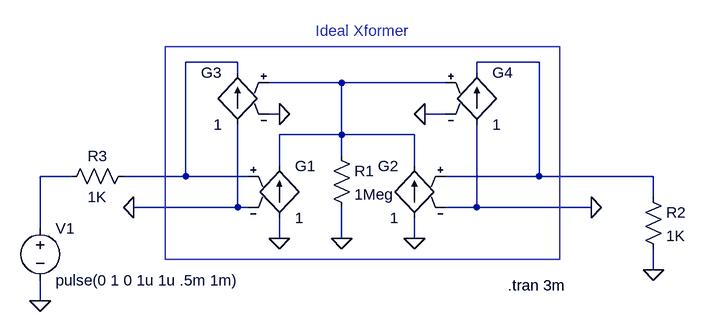
[diagram p0: schematic TxLin.asc]
TxLin.asc, the LTspice schematic file:
Version 4
SHEET 1 880 680
WIRE 0 240 -96 240
WIRE 0 288 -16 288
WIRE -16 288 -16 160
WIRE -16 288 -176 288
WIRE -16 80 -16 64
WIRE -16 64 -96 64
WIRE -96 64 -96 240
WIRE -96 240 -192 240
WIRE 304 240 448 240
WIRE 304 288 352 288
WIRE 352 288 352 160
WIRE 352 80 352 64
WIRE 352 64 448 64
WIRE 448 64 448 240
WIRE 448 240 624 240
WIRE 528 288 352 288
WIRE 48 336 48 304
WIRE 48 224 48 176
WIRE 48 176 144 176
WIRE 256 176 256 224
WIRE 256 304 256 336
WIRE 32 96 144 96
WIRE 144 96 144 176
WIRE 144 176 256 176
WIRE 144 96 304 96
WIRE 32 144 48 144
WIRE 304 144 272 144
WIRE 144 176 144 208
WIRE 144 288 144 336
WIRE -320 432 -320 400
WIRE -320 320 -320 240
WIRE 624 240 624 272
WIRE 624 352 624 384
WIRE -272 240 -320 240
FLAG 256 336 0
FLAG 48 336 0
FLAG 272 144 0
FLAG 48 144 0
FLAG 144 336 0
FLAG -176 288 0
FLAG 528 288 0
FLAG -320 432 0
FLAG 624 384 0
SYMBOL g 48 208 R0
SYMATTR InstName G1
SYMATTR Value 1
SYMBOL g 256 208 M0
SYMATTR InstName G2
SYMATTR Value 1
SYMBOL g -16 64 M0
SYMATTR InstName G3
SYMATTR Value 1
SYMBOL g 352 64 R0
SYMATTR InstName G4
SYMATTR Value 1
SYMBOL res 128 192 R0
SYMATTR InstName R1
SYMATTR Value 1Meg
SYMBOL voltage -320 304 R0
SYMATTR InstName V1
SYMATTR Value pulse(0 1 0 1u 1u .5m 1m)
SYMBOL res 608 256 R0
SYMATTR InstName R2
SYMATTR Value 1K
SYMBOL res -176 224 R90
WINDOW 0 0 56 VBottom 0
WINDOW 3 32 56 VTop 0
SYMATTR InstName R3
SYMATTR Value 1K
TEXT 400 408 Left 0 !.tran 3m
TEXT 104 16 Left 0 ;Ideal Xformer
LINE Normal 480 40 -128 40
LINE Normal 480 368 480 40
LINE Normal -128 368 480 368
LINE Normal -128 40 -128 368

The netlist it stands for:
* TxLin.asc
G1 0 N003 N001 0 1
G2 0 N003 N002 0 1
G3 0 N001 N003 0 1
G4 0 N002 N003 0 1
R1 N003 0 1Meg
V1 N004 0 pulse(0 1 0 1u 1u .5m 1m)
R2 N002 0 1K
R3 N001 N004 1K
.tran 3m
* Ideal Xformer
.backanno
.end